# Altium schematic sheet RowDotMatrixControl.SchDoc
size A4
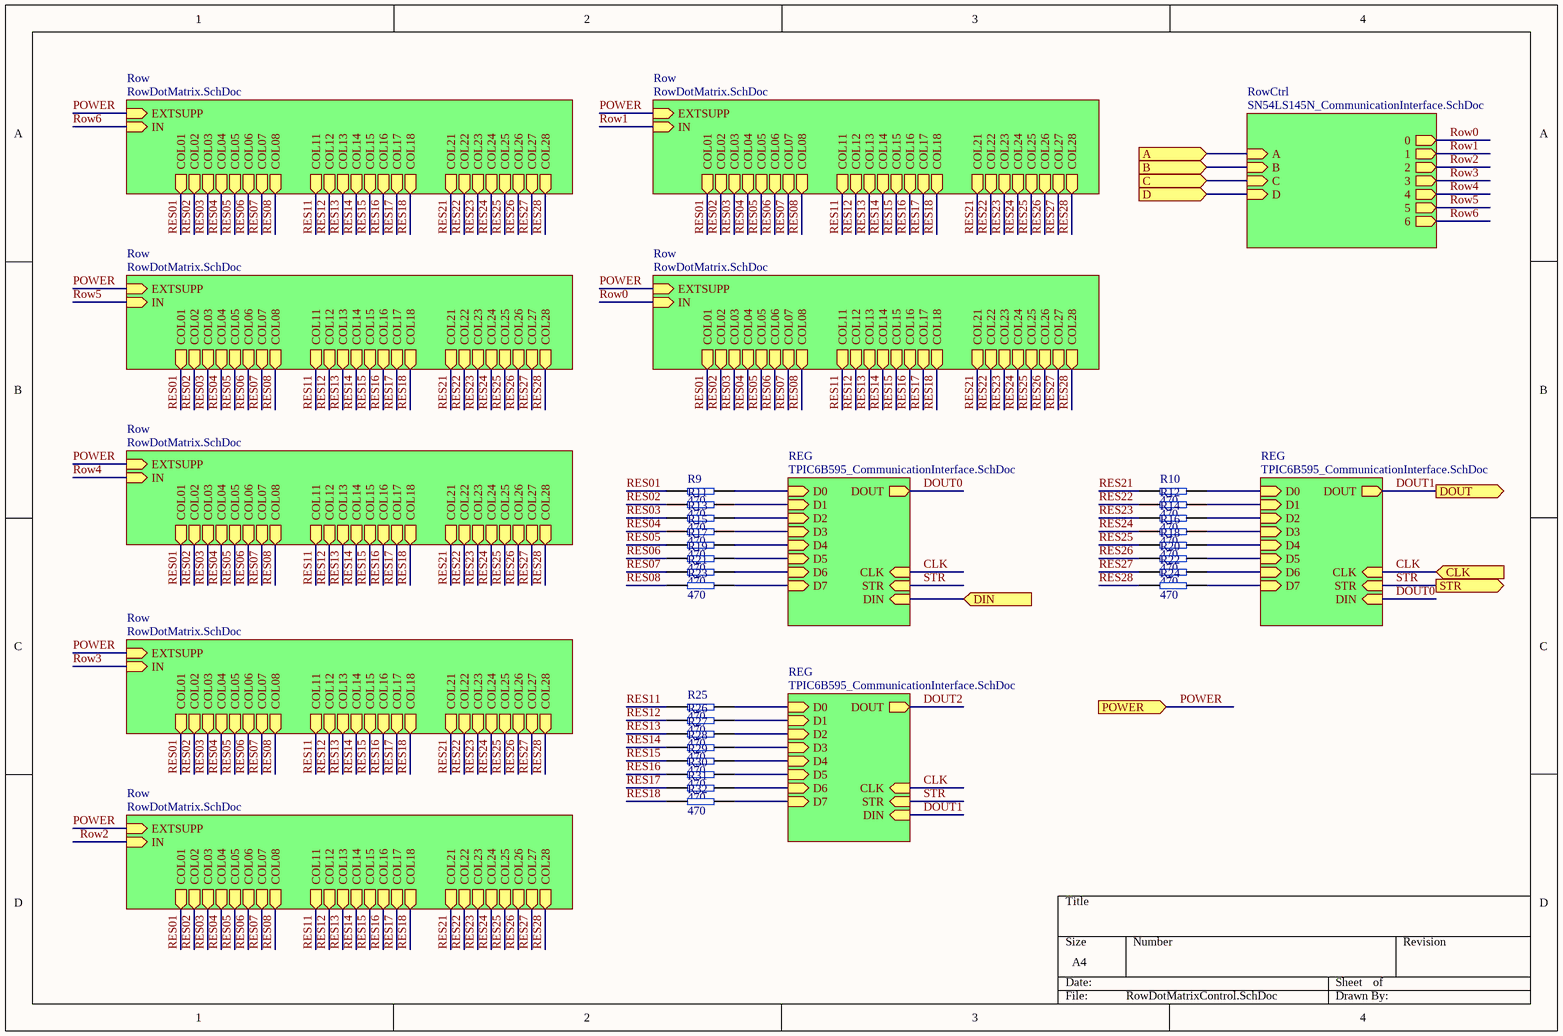
[diagram p0: RowDotMatrixControl.SchDoc]

## Parts
R9  value 470  [RES2512]  (hidden comment: RES470)
R10  value 470  [RES2512]  (hidden comment: RES470)
R11  value 470  [RES2512]  (hidden comment: RES470)
R12  value 470  [RES2512]  (hidden comment: RES470)
R13  value 470  [RES2512]  (hidden comment: RES470)
R14  value 470  [RES2512]  (hidden comment: RES470)
R15  value 470  [RES2512]  (hidden comment: RES470)
R16  value 470  [RES2512]  (hidden comment: RES470)
R17  value 470  [RES2512]  (hidden comment: RES470)
R18  value 470  [RES2512]  (hidden comment: RES470)
R19  value 470  [RES2512]  (hidden comment: RES470)
R20  value 470  [RES2512]  (hidden comment: RES470)
R21  value 470  [RES2512]  (hidden comment: RES470)
R22  value 470  [RES2512]  (hidden comment: RES470)
R23  value 470  [RES2512]  (hidden comment: RES470)
R24  value 470  [RES2512]  (hidden comment: RES470)
R25  value 470  [RES2512]  (hidden comment: RES470)
R26  value 470  [RES2512]  (hidden comment: RES470)
R27  value 470  [RES2512]  (hidden comment: RES470)
R28  value 470  [RES2512]  (hidden comment: RES470)
R29  value 470  [RES2512]  (hidden comment: RES470)
R30  value 470  [RES2512]  (hidden comment: RES470)
R31  value 470  [RES2512]  (hidden comment: RES470)
R32  value 470  [RES2512]  (hidden comment: RES470)

## Sub-sheets
REG = TPIC6B595_CommunicationInterface.SchDoc: D0 (in), D1 (in), D2 (in), D3 (in), D4 (in), D5 (in), D6 (in), D7 (in), DIN (in), DOUT (out), STR (in), CLK (in)
REG = TPIC6B595_CommunicationInterface.SchDoc: D0 (in), D1 (in), D2 (in), D3 (in), D4 (in), D5 (in), D6 (in), D7 (in), DIN (in), DOUT (out), STR (in), CLK (in)
REG = TPIC6B595_CommunicationInterface.SchDoc: D0 (in), D1 (in), D2 (in), D3 (in), D4 (in), D5 (in), D6 (in), D7 (in), DIN (in), DOUT (out), STR (in), CLK (in)
Row = RowDotMatrix.SchDoc: EXTSUPP (in), COL01 (out), COL02 (out), COL03 (out), COL04 (out), COL05 (out), COL06 (out), COL07 (out), COL08 (out), COL11 (out), COL12 (out), COL13 (out), COL14 (out), COL15 (out), COL16 (out), COL17 (out), COL18 (out), COL21 (out), COL22 (out), COL23 (out), COL24 (out), COL25 (out), COL26 (out), COL27 (out), COL28 (out), IN (in)
Row = RowDotMatrix.SchDoc: EXTSUPP (in), COL01 (out), COL02 (out), COL03 (out), COL04 (out), COL05 (out), COL06 (out), COL07 (out), COL08 (out), COL11 (out), COL12 (out), COL13 (out), COL14 (out), COL15 (out), COL16 (out), COL17 (out), COL18 (out), COL21 (out), COL22 (out), COL23 (out), COL24 (out), COL25 (out), COL26 (out), COL27 (out), COL28 (out), IN (in)
Row = RowDotMatrix.SchDoc: EXTSUPP (in), COL01 (out), COL02 (out), COL03 (out), COL04 (out), COL05 (out), COL06 (out), COL07 (out), COL08 (out), COL11 (out), COL12 (out), COL13 (out), COL14 (out), COL15 (out), COL16 (out), COL17 (out), COL18 (out), COL21 (out), COL22 (out), COL23 (out), COL24 (out), COL25 (out), COL26 (out), COL27 (out), COL28 (out), IN (in)
Row = RowDotMatrix.SchDoc: EXTSUPP (in), COL01 (out), COL02 (out), COL03 (out), COL04 (out), COL05 (out), COL06 (out), COL07 (out), COL08 (out), COL11 (out), COL12 (out), COL13 (out), COL14 (out), COL15 (out), COL16 (out), COL17 (out), COL18 (out), COL21 (out), COL22 (out), COL23 (out), COL24 (out), COL25 (out), COL26 (out), COL27 (out), COL28 (out), IN (in)
Row = RowDotMatrix.SchDoc: EXTSUPP (in), COL01 (out), COL02 (out), COL03 (out), COL04 (out), COL05 (out), COL06 (out), COL07 (out), COL08 (out), COL11 (out), COL12 (out), COL13 (out), COL14 (out), COL15 (out), COL16 (out), COL17 (out), COL18 (out), COL21 (out), COL22 (out), COL23 (out), COL24 (out), COL25 (out), COL26 (out), COL27 (out), COL28 (out), IN (in)
Row = RowDotMatrix.SchDoc: EXTSUPP (in), COL01 (out), COL02 (out), COL03 (out), COL04 (out), COL05 (out), COL06 (out), COL07 (out), COL08 (out), COL11 (out), COL12 (out), COL13 (out), COL14 (out), COL15 (out), COL16 (out), COL17 (out), COL18 (out), COL21 (out), COL22 (out), COL23 (out), COL24 (out), COL25 (out), COL26 (out), COL27 (out), COL28 (out), IN (in)
Row = RowDotMatrix.SchDoc: EXTSUPP (in), COL01 (out), COL02 (out), COL03 (out), COL04 (out), COL05 (out), COL06 (out), COL07 (out), COL08 (out), COL11 (out), COL12 (out), COL13 (out), COL14 (out), COL15 (out), COL16 (out), COL17 (out), COL18 (out), COL21 (out), COL22 (out), COL23 (out), COL24 (out), COL25 (out), COL26 (out), COL27 (out), COL28 (out), IN (in)
RowCtrl = SN54LS145N_CommunicationInterface.SchDoc: A (in), B (in), C (in), D (in), 0 (out), 1 (out), 2 (out), 3 (out), 4 (out), 5 (out), 6 (out)

## Ports
A (in), B (in), C (in), CLK (in), D (in), DIN (in), DOUT (out), POWER (in), STR (out)

## Nets
A: port A, sheet RowCtrl/A
B: port B, sheet RowCtrl/B
C: port C, sheet RowCtrl/C
CLK: port CLK, sheet REG/CLK, sheet REG/CLK, sheet REG/CLK
D: port D, sheet RowCtrl/D
DIN: port DIN, sheet REG/DIN
DOUT0: sheet REG/DOUT, sheet REG/DIN
DOUT1: port DOUT, sheet REG/DIN, sheet REG/DOUT
DOUT2: sheet REG/DOUT
POWER: port POWER, sheet Row/EXTSUPP, sheet Row/EXTSUPP, sheet Row/EXTSUPP, sheet Row/EXTSUPP, sheet Row/EXTSUPP, sheet Row/EXTSUPP, sheet Row/EXTSUPP
RES01: R9.1(pos) ; sheet Row/COL01, sheet Row/COL01, sheet Row/COL01, sheet Row/COL01, sheet Row/COL01, sheet Row/COL01, sheet Row/COL01
RES02: R11.1(pos) ; sheet Row/COL02, sheet Row/COL02, sheet Row/COL02, sheet Row/COL02, sheet Row/COL02, sheet Row/COL02, sheet Row/COL02
RES03: R13.1(pos) ; sheet Row/COL03, sheet Row/COL03, sheet Row/COL03, sheet Row/COL03, sheet Row/COL03, sheet Row/COL03, sheet Row/COL03
RES04: R15.1(pos) ; sheet Row/COL04, sheet Row/COL04, sheet Row/COL04, sheet Row/COL04, sheet Row/COL04, sheet Row/COL04, sheet Row/COL04
RES05: R17.1(pos) ; sheet Row/COL05, sheet Row/COL05, sheet Row/COL05, sheet Row/COL05, sheet Row/COL05, sheet Row/COL05, sheet Row/COL05
RES06: R19.1(pos) ; sheet Row/COL06, sheet Row/COL06, sheet Row/COL06, sheet Row/COL06, sheet Row/COL06, sheet Row/COL06, sheet Row/COL06
RES07: R21.1(pos) ; sheet Row/COL07, sheet Row/COL07, sheet Row/COL07, sheet Row/COL07, sheet Row/COL07, sheet Row/COL07, sheet Row/COL07
RES08: R23.1(pos) ; sheet Row/COL08, sheet Row/COL08, sheet Row/COL08, sheet Row/COL08, sheet Row/COL08, sheet Row/COL08, sheet Row/COL08
RES11: R25.1(pos) ; sheet Row/COL11, sheet Row/COL11, sheet Row/COL11, sheet Row/COL11, sheet Row/COL11, sheet Row/COL11, sheet Row/COL11
RES12: R26.1(pos) ; sheet Row/COL12, sheet Row/COL12, sheet Row/COL12, sheet Row/COL12, sheet Row/COL12, sheet Row/COL12, sheet Row/COL12
RES13: R27.1(pos) ; sheet Row/COL13, sheet Row/COL13, sheet Row/COL13, sheet Row/COL13, sheet Row/COL13, sheet Row/COL13, sheet Row/COL13
RES14: R28.1(pos) ; sheet Row/COL14, sheet Row/COL14, sheet Row/COL14, sheet Row/COL14, sheet Row/COL14, sheet Row/COL14, sheet Row/COL14
RES15: R29.1(pos) ; sheet Row/COL15, sheet Row/COL15, sheet Row/COL15, sheet Row/COL15, sheet Row/COL15, sheet Row/COL15, sheet Row/COL15
RES16: R30.1(pos) ; sheet Row/COL16, sheet Row/COL16, sheet Row/COL16, sheet Row/COL16, sheet Row/COL16, sheet Row/COL16, sheet Row/COL16
RES17: R31.1(pos) ; sheet Row/COL17, sheet Row/COL17, sheet Row/COL17, sheet Row/COL17, sheet Row/COL17, sheet Row/COL17, sheet Row/COL17
RES18: R32.1(pos) ; sheet Row/COL18, sheet Row/COL18, sheet Row/COL18, sheet Row/COL18, sheet Row/COL18, sheet Row/COL18, sheet Row/COL18
RES21: R10.1(pos) ; sheet Row/COL21, sheet Row/COL21, sheet Row/COL21, sheet Row/COL21, sheet Row/COL21, sheet Row/COL21, sheet Row/COL21
RES22: R12.1(pos) ; sheet Row/COL22, sheet Row/COL22, sheet Row/COL22, sheet Row/COL22, sheet Row/COL22, sheet Row/COL22, sheet Row/COL22
RES23: R14.1(pos) ; sheet Row/COL23, sheet Row/COL23, sheet Row/COL23, sheet Row/COL23, sheet Row/COL23, sheet Row/COL23, sheet Row/COL23
RES24: R16.1(pos) ; sheet Row/COL24, sheet Row/COL24, sheet Row/COL24, sheet Row/COL24, sheet Row/COL24, sheet Row/COL24, sheet Row/COL24
RES25: R18.1(pos) ; sheet Row/COL25, sheet Row/COL25, sheet Row/COL25, sheet Row/COL25, sheet Row/COL25, sheet Row/COL25, sheet Row/COL25
RES26: R20.1(pos) ; sheet Row/COL26, sheet Row/COL26, sheet Row/COL26, sheet Row/COL26, sheet Row/COL26, sheet Row/COL26, sheet Row/COL26
RES27: R22.1(pos) ; sheet Row/COL27, sheet Row/COL27, sheet Row/COL27, sheet Row/COL27, sheet Row/COL27, sheet Row/COL27, sheet Row/COL27
RES28: R24.1(pos) ; sheet Row/COL28, sheet Row/COL28, sheet Row/COL28, sheet Row/COL28, sheet Row/COL28, sheet Row/COL28, sheet Row/COL28
Row0: sheet RowCtrl/0, sheet Row/IN
Row1: sheet RowCtrl/1, sheet Row/IN
Row2: sheet RowCtrl/2, sheet Row/IN
Row3: sheet RowCtrl/3, sheet Row/IN
Row4: sheet RowCtrl/4, sheet Row/IN
Row5: sheet RowCtrl/5, sheet Row/IN
Row6: sheet RowCtrl/6, sheet Row/IN
STR: port STR, sheet REG/STR, sheet REG/STR, sheet REG/STR
NetR9_2: R9.2(neg) ; sheet REG/D0
NetR10_2: R10.2(neg) ; sheet REG/D0
NetR11_2: R11.2(neg) ; sheet REG/D1
NetR12_2: R12.2(neg) ; sheet REG/D1
NetR13_2: R13.2(neg) ; sheet REG/D2
NetR14_2: R14.2(neg) ; sheet REG/D2
NetR15_2: R15.2(neg) ; sheet REG/D3
NetR16_2: R16.2(neg) ; sheet REG/D3
NetR17_2: R17.2(neg) ; sheet REG/D4
NetR18_2: R18.2(neg) ; sheet REG/D4
NetR19_2: R19.2(neg) ; sheet REG/D5
NetR20_2: R20.2(neg) ; sheet REG/D5
NetR21_2: R21.2(neg) ; sheet REG/D6
NetR22_2: R22.2(neg) ; sheet REG/D6
NetR23_2: R23.2(neg) ; sheet REG/D7
NetR24_2: R24.2(neg) ; sheet REG/D7
NetR25_2: R25.2(neg) ; sheet REG/D0
NetR26_2: R26.2(neg) ; sheet REG/D1
NetR27_2: R27.2(neg) ; sheet REG/D2
NetR28_2: R28.2(neg) ; sheet REG/D3
NetR29_2: R29.2(neg) ; sheet REG/D4
NetR30_2: R30.2(neg) ; sheet REG/D5
NetR31_2: R31.2(neg) ; sheet REG/D6
NetR32_2: R32.2(neg) ; sheet REG/D7

## Library data of the parts
R9-R32 = RES470: Resistores de película gruesa - SMD 1watt 470ohms 5%; MPN: CRCW2512470RJNEG; Supplier: Mouser; Supplier PN: 71-CRCW2512J-470-E3